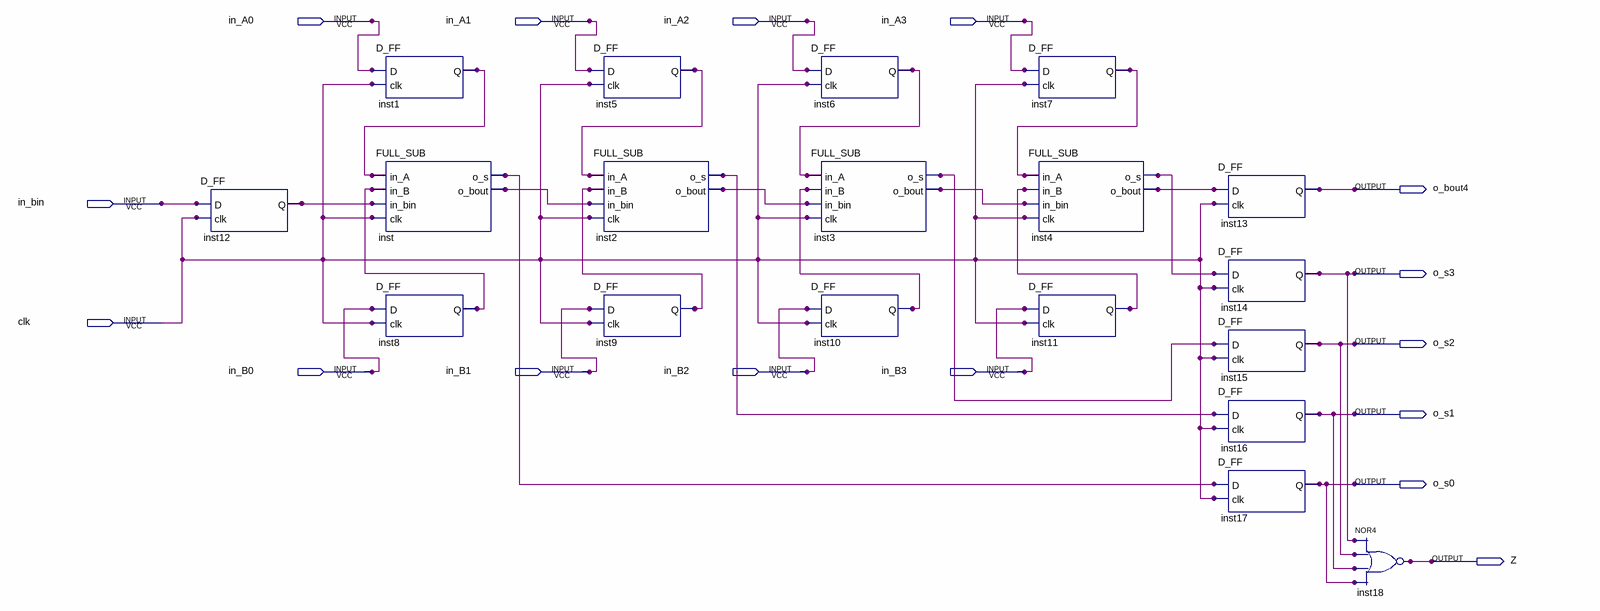
[diagram p0: schematic sheet]
// Quartus schematic 4bit_FULL_SUB.bdf as structural Verilog: 19 symbols, 16 pins
module \4bit_FULL_SUB  (
  input  in_A0,
  input  in_A1,
  input  in_A2,
  input  in_A3,
  input  in_bin,
  input  clk,
  input  in_B0,
  input  in_B1,
  input  in_B2,
  input  in_B3,
  output o_bout4,
  output o_s3,
  output o_s2,
  output o_s1,
  output o_s0,
  output Z
);

  wire inst1_q, inst2_o_bout, inst2_o_s, inst3_o_bout, inst3_o_s, inst4_o_bout, inst4_o_s, inst5_q, inst6_q,
       inst7_q, inst8_q, inst9_q, inst10_q, inst11_q, inst12_q, inst_o_bout, inst_o_s;

  D_FF inst12 (.D(in_bin), .clk(clk), .Q(inst12_q));
  D_FF inst1 (.D(in_A0), .clk(clk), .Q(inst1_q));
  FULL_SUB inst (.in_A(inst1_q), .in_B(inst8_q), .in_bin(inst12_q), .clk(clk), .o_s(inst_o_s), .o_bout(inst_o_bout));
  D_FF inst8 (.D(in_B0), .clk(clk), .Q(inst8_q));
  D_FF inst5 (.D(in_A1), .clk(clk), .Q(inst5_q));
  FULL_SUB inst2 (
    .in_A(inst5_q), .in_B(inst9_q), .in_bin(inst_o_bout), .clk(clk), .o_s(inst2_o_s), .o_bout(inst2_o_bout));
  D_FF inst9 (.D(in_B1), .clk(clk), .Q(inst9_q));
  D_FF inst6 (.D(in_A2), .clk(clk), .Q(inst6_q));
  FULL_SUB inst3 (
    .in_A(inst6_q), .in_B(inst10_q), .in_bin(inst2_o_bout), .clk(clk), .o_s(inst3_o_s), .o_bout(inst3_o_bout));
  D_FF inst10 (.D(in_B2), .clk(clk), .Q(inst10_q));
  D_FF inst7 (.D(in_A3), .clk(clk), .Q(inst7_q));
  FULL_SUB inst4 (
    .in_A(inst7_q), .in_B(inst11_q), .in_bin(inst3_o_bout), .clk(clk), .o_s(inst4_o_s), .o_bout(inst4_o_bout));
  D_FF inst11 (.D(in_B3), .clk(clk), .Q(inst11_q));
  D_FF inst13 (.D(inst4_o_bout), .clk(clk), .Q(o_bout4));
  D_FF inst14 (.D(inst4_o_s), .clk(clk), .Q(o_s3));
  D_FF inst15 (.D(inst3_o_s), .clk(clk), .Q(o_s2));
  D_FF inst16 (.D(inst2_o_s), .clk(clk), .Q(o_s1));
  D_FF inst17 (.D(inst_o_s), .clk(clk), .Q(o_s0));
  nor inst18 (Z, o_s3, o_s2, o_s1, o_s0);
endmodule
